# Altium project CM4_mini_BOT.PrjPcb
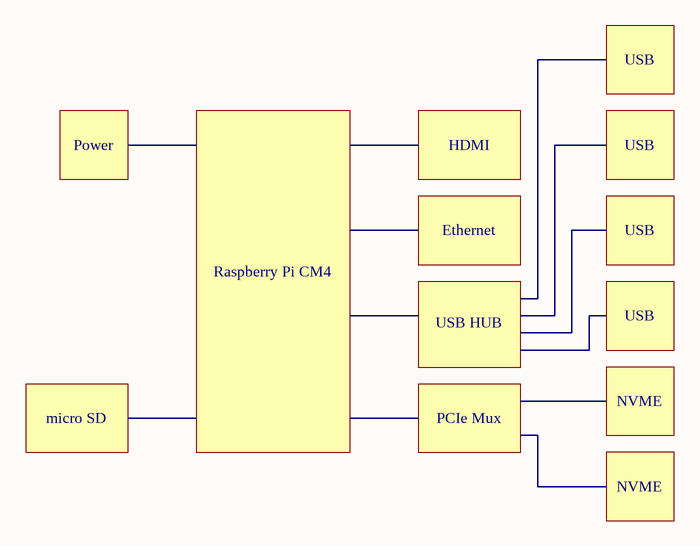
[diagram p0: Block scheme.SchDoc]
8 sheets, 60 parts. Net scope: global (net labels, ports and power ports of the same name join across sheets).
Board file: CM4mini.PcbDoc
Sheets:
  Block scheme.SchDoc
  Power block scheme.SchDoc
  CM4.SchDoc
  Fan.SchDoc
  MicroSD Card.SchDoc
  Power.SchDoc
  USB A.SchDoc
  M.2 m-key.SchDoc

## Sheet Block scheme.SchDoc
size A4; Organization: My Company; Address1: Address Line 1; Address2: Address Line 2; Address3: Address Line 3; Address4: Address Line 4; SheetNumber: 1; SheetTotal: 8

### Notes on the sheet
- USB
- Power
- HDMI
- Ethernet
- Raspberry Pi CM4
- USB HUB
- NVME
- micro SD
- PCIe Mux
- Title:
- Author:
- Approved:
- Size:
- Date:
- Git Hash:
- A4
- Prj:
- SW Version:
- Variant:
- Edited:
- CONFIDENTIAL
- File:

## Sheet Power block scheme.SchDoc
size A4; Organization: My Company; Address1: Address Line 1; Address2: Address Line 2; Address3: Address Line 3; Address4: Address Line 4; SheetNumber: 2; SheetTotal: 8
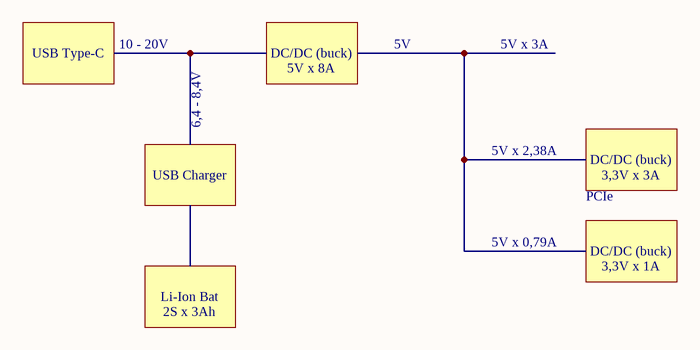
[diagram p1: Power block scheme.SchDoc]

### Notes on the sheet
- USB Type-C
- 10 - 20V
- DC/DC (buck)
- 5V x 8A
- 5V
- 5V x 3A
- 6,4 - 8,4V
- 5V x 2,38A
- USB Charger
- PCIe
- 3,3V x 3A
- Li-Ion Bat
- 2S x 3Ah
- 5V x 0,79A
- 3,3V x 1A
- Title:
- Author:
- Approved:
- Size:
- Date:
- Git Hash:
- A4
- Prj:
- SW Version:
- Variant:
- Edited:
- CONFIDENTIAL
- File:

## Sheet CM4.SchDoc
size A4; SheetNumber: 3; SheetTotal: 8
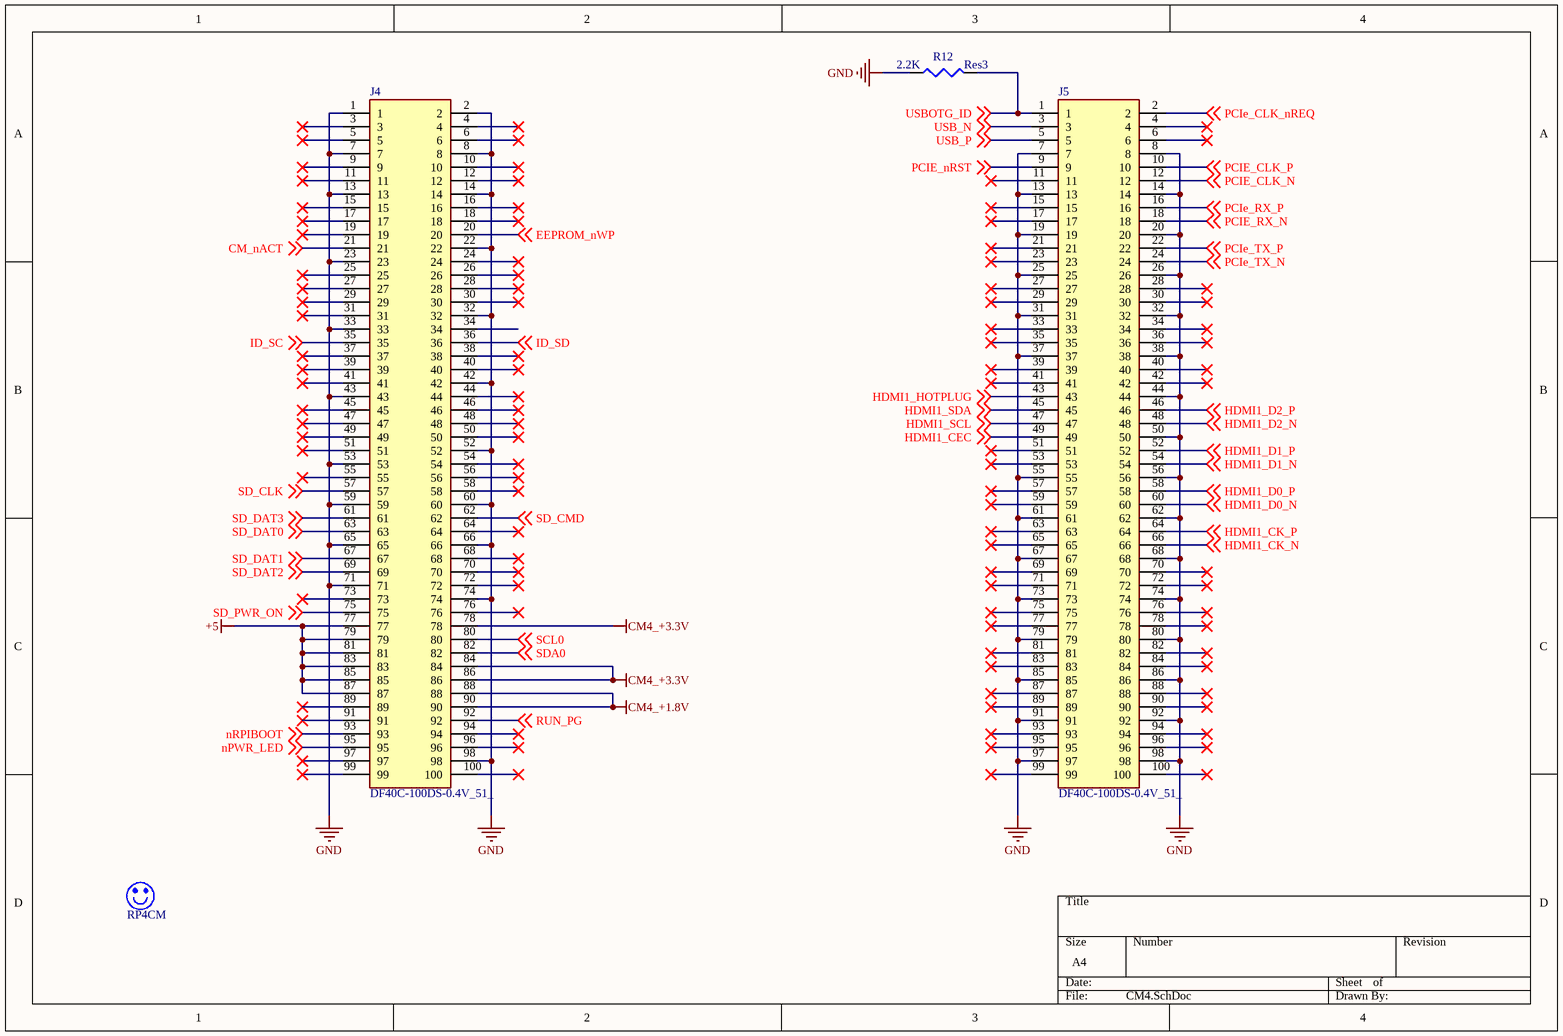
[diagram p2: CM4.SchDoc]

### Parts
J4  DF40C-100DS-0.4V_51_  [DF40C100DS04V51]
J5  DF40C-100DS-0.4V_51_  [DF40C100DS04V51]
M?  RP4CM  [RP4CM0]  (mechanical)
R12  Res3  value 2.2K  [J1-0603]

### Nets
+5: J4.77 J4.79 J4.81 J4.83 J4.85 J4.87
CM4_+1.8V: J4.88 J4.90
CM4_+3.3V: J4.78 J4.84 J4.86
GND: J4.1 J4.2 J4.7 J4.8 J4.13 J4.14 J4.22 J4.23 J4.32 J4.33 J4.42 J4.43 J4.52 J4.53 J4.59 J4.60 J4.65 J4.66 J4.71 J4.74 J4.98 J5.7 J5.8 J5.13 J5.14 J5.19 J5.20 J5.25 J5.26 J5.31 J5.32 J5.37 J5.38 J5.44 J5.50 J5.55 J5.56 J5.61 J5.62 J5.67 J5.68 J5.73 J5.74 J5.79 J5.80 J5.85 J5.86 J5.91 J5.92 J5.97 J5.98 R12.1  [project net PWR_SW]
CM_nACT: J4.21 ; off-sheet CM_nACT
EEPROM_nWP: J4.20 ; off-sheet EEPROM_nWP
HDMI1_CEC: J5.49 ; off-sheet HDMI1_CEC
HDMI1_CK_N: J5.66 ; off-sheet HDMI1_CK_N
HDMI1_CK_P: J5.64 ; off-sheet HDMI1_CK_P
HDMI1_D0_N: J5.60 ; off-sheet HDMI1_D0_N
HDMI1_D0_P: J5.58 ; off-sheet HDMI1_D0_P
HDMI1_D1_N: J5.54 ; off-sheet HDMI1_D1_N
HDMI1_D1_P: J5.52 ; off-sheet HDMI1_D1_P
HDMI1_D2_N: J5.48 ; off-sheet HDMI1_D2_N
HDMI1_D2_P: J5.46 ; off-sheet HDMI1_D2_P
HDMI1_HOTPLUG: J5.43 ; off-sheet HDMI1_HOTPLUG
HDMI1_SCL: J5.47 ; off-sheet HDMI1_SCL
HDMI1_SDA: J5.45 ; off-sheet HDMI1_SDA
ID_SC: J4.35 ; off-sheet ID_SC
ID_SD: J4.36 ; off-sheet ID_SD
nPWR_LED: J4.95 ; off-sheet nPWR_LED
nRPIBOOT: J4.93 ; off-sheet nRPIBOOT
PCIe_CLK_N: J5.12 ; off-sheet PCIE_CLK_N
PCIe_CLK_nREQ: J5.2 ; off-sheet PCIe_CLK_nREQ
PCIe_CLK_P: J5.10 ; off-sheet PCIE_CLK_P
PCIe_nRST: J5.9 ; off-sheet PCIE_nRST
PCIe_RX_N: J5.18 ; off-sheet PCIE_RX_N
PCIe_RX_P: J5.16 ; off-sheet PCIe_RX_P
PCIe_TX_N: J5.24 ; off-sheet PCIe_TX_N
PCIe_TX_P: J5.22 ; off-sheet PCIe_TX_P
RUN_PG: J4.92 ; off-sheet RUN_PG
SCL0: J4.80 ; off-sheet SCL0
SD_CLK: J4.57 ; off-sheet SD_CLK
SD_CMD: J4.62 ; off-sheet SD_CMD
SD_DAT0: J4.63 ; off-sheet SD_DAT0
SD_DAT1: J4.67 ; off-sheet SD_DAT1
SD_DAT2: J4.69 ; off-sheet SD_DAT2
SD_DAT3: J4.61 ; off-sheet SD_DAT3
SD_PWR_ON: J4.75 ; off-sheet SD_PWR_ON
SDA0: J4.82 ; off-sheet SDA0
USB_N: J5.3 ; off-sheet USB_N
USB_P: J5.5 ; off-sheet USB_P
USBOTG_ID: J5.1 R12.2 ; off-sheet USBOTG_ID

Not connected (* = marked no-connect by the designer): J4 3* 4* 5* 6* 9* 10* 11* 12* 15* 16* 17* 18* 19* 24* 25* 26* 27* 28* 29* 30* 31* 34 37* 38* 39* 40* 41* 44* 45* 46* 47* 48* 49* 50* 51* 54* 55* 56* 58* 64* 68* 70* 72* 73* 76* 89* 91* 94* 96* 97* 99* 100*; J5 4* 6* 11* 15* 17* 21* 23* 27* 28* 29* 30* 33* 34* 35* 36* 39* 40* 41* 42* 51* 53* 57* 59* 63* 65* 69* 70* 71* 72* 75* 76* 77* 78* 81* 82* 83* 84* 87* 88* 89* 90* 93* 94* 95* 96* 99* 100*

### Library data of the parts
J4 J5 = DF40C-100DS-0.4V_51_: Connector; Manufacturer_Name: Hirose; Manufacturer_Part_Number: DF40C-100DS-0.4V(51); Datasheet Link: https://www.hirose.com/product/en/download_file/key_name/DF40C-100DS-0.4V%2851%29/category/Drawing%20(2D)/doc_file_id/46856/?file_category_id=6&item_id=06844033451&is_series=; Height: 1.65mm; Mouser Part Number: 798-DF40C100DS0.4V51; Mouser Price/Stock: https://www.mouser.co.uk/ProductDetail/Hirose-Connector/DF40C-100DS-04V51?qs=eDUdFcBPps2MEwbnuPvZzQ%3D%3D; Arrow Part Number: DF40C-100DS-0.4V(51); Arrow Price/Stock: https://www.arrow.com/en/products/df40c-100ds-0.4v-51/hirose-electric
M? = RP4CM: Raspberry Pi  Computed Module 4
R12 = Res3: Resistor; Published: 8-Jun-2000; LatestRevisionDate: 29-May-2009; LatestRevisionNote: IPC-7351 Footprint Added.; PackageReference: J1-0603; Publisher: Altium Limited; PackageDescription: Chip Resistor

## Sheet Fan.SchDoc
size A4; SheetNumber: 4; SheetTotal: 8
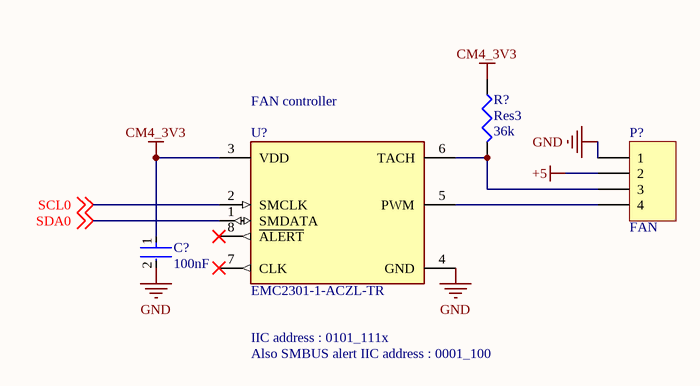
[diagram p3: Fan.SchDoc]

### Parts
(Parts that share a designator on the sheet are numbered #1, #2 ... from top to bottom, then left to right.)
C?#1  100nF  [FP-CC0603-DA-MFG]
P?  FAN  [HDR1X4]
R?  Res3  value 36k  [J1-0603]
U?#1  EMC2301-1-ACZL-TR  [FP-MO-8-TSSOP-3x3-IPC_C]

### Nets
+5: P?.2
CM4_3V3: C?#1.1 R?.1 U?#1.3(VDD)
GND: C?#1.2 P?.1 U?#1.4(GND)  [project net PWR_SW]
SCL0: U?#1.2(SMCLK) ; off-sheet SCL0
SDA0: U?#1.1(SMDATA) ; off-sheet SDA0
NetP?_3: P?.3 R?.2 U?#1.6(TACH)
NetP?_4: P?.4 U?#1.5(PWM)

Not connected (* = marked no-connect by the designer): U?#1 7(CLK)* 8(~{ALERT})*

### Notes on the sheet
- (near U?#1) FAN controller
- IIC address : 0101_111x
- Also SMBUS alert IIC address : 0001_100
- Title:
- Author:
- Approved:
- Size:
- Date:
- Git Hash:
- A4
- Prj:
- SW Version:
- Variant:
- Edited:
- CONFIDENTIAL
- File:

### Library data of the parts
C?#1 = CMP-03422-000924-1: CAP CER 1UF 16V X7R 0603; Manufacturer: YAGEO; Manufacturer Part Number: CC0603KRX7R7BB105; Tolerance: 0.1; Temperature Coefficient: 15%; Material: Ceramic; Package: CC0603-DA; RoHS: TRUE; Device Class L2: Capacitors; Temperature Characteristic: X7R; Temperature: -55°C to +125°C; Temperature Range Low: -55°C; Automotive: No; ComponentLink2Description: Datasheet; Value: 1 uF; Lead Free: Yes; Capacitance: 1 uF; ComponentLink2URL: http://www.yageo.com/documents/recent/UPY-GPHC_X7R_6.3V-to-50V_18.pdf; Device Class L1: Passive Components; Voltage: 16 V; Octopart: https://octopart.com/cc0603krx7r7bb105-yageo-42271928; Category: Cap; Digikey Description: CAP CER 1UF 16V X7R 0603; Footprint Url: http://www.yageo.com/exep/pages/download/literatures/UPY-C_GEN_24.pdf; Height: 0.9mm; Voltage Rating: 16 V; Temperature Range High: +125°C; Mouser Description: Multilayer Ceramic Capacitor, CC Series, 1 - F, - 10%, X7R, 16 V, 0603 [1608 Metric]; Device Class L3: Ceramic Capacitors
P? = Header 4: Header, 4-Pin; LatestRevisionDate: 17-Jul-2002; LatestRevisionNote: Re-released for DXP Platform.; Publisher: Altium Limited
R? = Res3: Resistor; Published: 8-Jun-2000; LatestRevisionDate: 29-May-2009; LatestRevisionNote: IPC-7351 Footprint Added.; PackageReference: J1-0603; Publisher: Altium Limited; PackageDescription: Chip Resistor
U?#1 = CMP-06322-000001-1: IC MOTOR DRIVER 3V-3.6V 8MSOP; Interface: PWM; Min Supply Voltage: 3V; Max Supply Voltage (DC): 3.6V; Operating Supply Current: 350uA; Output Type: Digital; Operating Supply Voltage: 3.3V; Min Supply Voltage (DC): 3V; Min Operating Temperature: -40°C; Number of Pins: 8; Series: -; Max Operating Temperature: 125°C; Case/Package: MSOP; Lead Free: Lead Free; Packaging: Tape and Reel; Package Quantity: 1; Mount: Surface Mount; Max Supply Voltage: 3.6V

## Sheet MicroSD Card.SchDoc
size A4; SheetNumber: 5; SheetTotal: 8
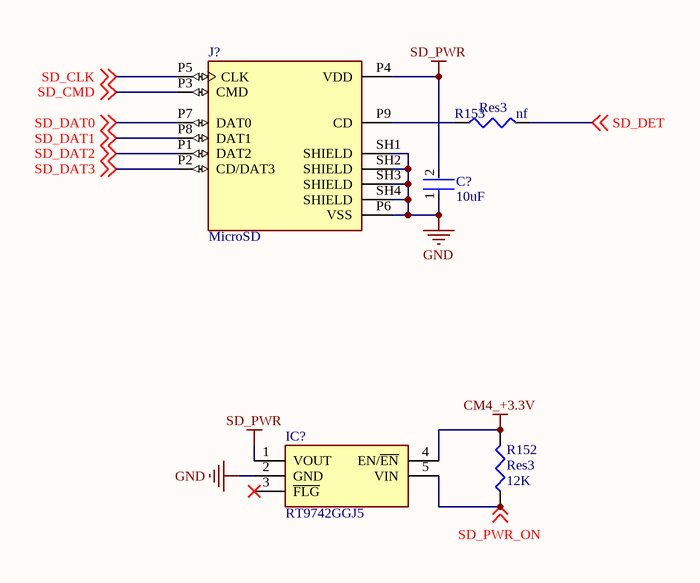
[diagram p4: MicroSD Card.SchDoc]

### Parts
(Parts that share a designator on the sheet are numbered #1, #2 ... from top to bottom, then left to right.)
C?#2  10uF  [FP-CC0603-DA-MFG]
IC?  RT9742GGJ5  [SOT94P280X100-5N]
J?  MicroSD  [GCT_MEM2075-00-140-01-A]
R152  Res3  value 12K  [J1-0603]
R153  Res3  value nf  [J1-0603]

### Nets
CM4_+3.3V: IC?.4(EN/~{EN}) R152.2
GND: C?#2.1 IC?.2(GND) J?.P6(VSS) J?.SH1(SHIELD) J?.SH2(SHIELD) J?.SH3(SHIELD) J?.SH4(SHIELD)  [project net PWR_SW]
SD_PWR: C?#2.2 IC?.1(VOUT) J?.P4(VDD)
SD_CLK: J?.P5(CLK) ; off-sheet SD_CLK
SD_CMD: J?.P3(CMD) ; off-sheet SD_CMD
SD_DAT0: J?.P7(DAT0) ; off-sheet SD_DAT0
SD_DAT1: J?.P8(DAT1) ; off-sheet SD_DAT1
SD_DAT2: J?.P1(DAT2) ; off-sheet SD_DAT2
SD_DAT3: J?.P2(CD/DAT3) ; off-sheet SD_DAT3
SD_DET: R153.2 ; off-sheet SD_DET
SD_PWR_ON: IC?.5(VIN) R152.1 ; off-sheet SD_PWR_ON
NetJ?_P9: J?.P9(CD) R153.1

Not connected (* = marked no-connect by the designer): IC? 3(~{FLG})*

### Library data of the parts
C?#2 = CMP-03422-000924-1: as C?#1 on sheet Fan; Package: CC0603-DA; RoHS: TRUE; Device Class L2: Capacitors; Temperature Characteristic: X7R; Temperature: -55°C to +125°C; Temperature Range Low: -55°C; Automotive: No; ComponentLink2Description: Datasheet; Value: 1 uF; Lead Free: Yes; Capacitance: 1 uF; ComponentLink2URL: http://www.yageo.com/documents/recent/UPY-GPHC_X7R_6.3V-to-50V_18.pdf; Device Class L1: Passive Components; Voltage: 16 V; Octopart: https://octopart.com/cc0603krx7r7bb105-yageo-42271928; Category: Cap; Digikey Description: CAP CER 1UF 16V X7R 0603; Footprint Url: http://www.yageo.com/exep/pages/download/literatures/UPY-C_GEN_24.pdf; Height: 0.9mm; Voltage Rating: 16 V; Temperature Range High: +125°C; Mouser Description: Multilayer Ceramic Capacitor, CC Series, 1 - F, - 10%, X7R, 16 V, 0603 [1608 Metric]; Device Class L3: Ceramic Capacitors
IC? = RT9742GGJ5: Integrated Circuit; Manufacturer_Name: RICHTEK; Datasheet Link: https://componentsearchengine.com/Datasheets/2/RT9742GGJ5.pdf; Height: 1mm; Manufacturer_Part_Number: RT9742GGJ5
J? = MEM2075-00-140-01-A: 9 _8 + 1_ Position Card Connector microSDâ„¢ Surface Mount, Right Angle Gold; MF: Global Connector Technology; Availability: Unavailable; Price: None; SnapEDA_Link: https://www.snapeda.com/parts/MEM2075-00-140-01-A/Global%20Connector%20Technology/view-part/2680480/?ref=snap; Value: *; Package: Package Analog Devices; MP: MEM2075-00-140-01-A
R152 R153 = Res3: Resistor; Published: 8-Jun-2000; LatestRevisionDate: 29-May-2009; LatestRevisionNote: IPC-7351 Footprint Added.; PackageReference: J1-0603; Publisher: Altium Limited; PackageDescription: Chip Resistor

## Sheet Power.SchDoc
size A4; SheetNumber: 6; SheetTotal: 8
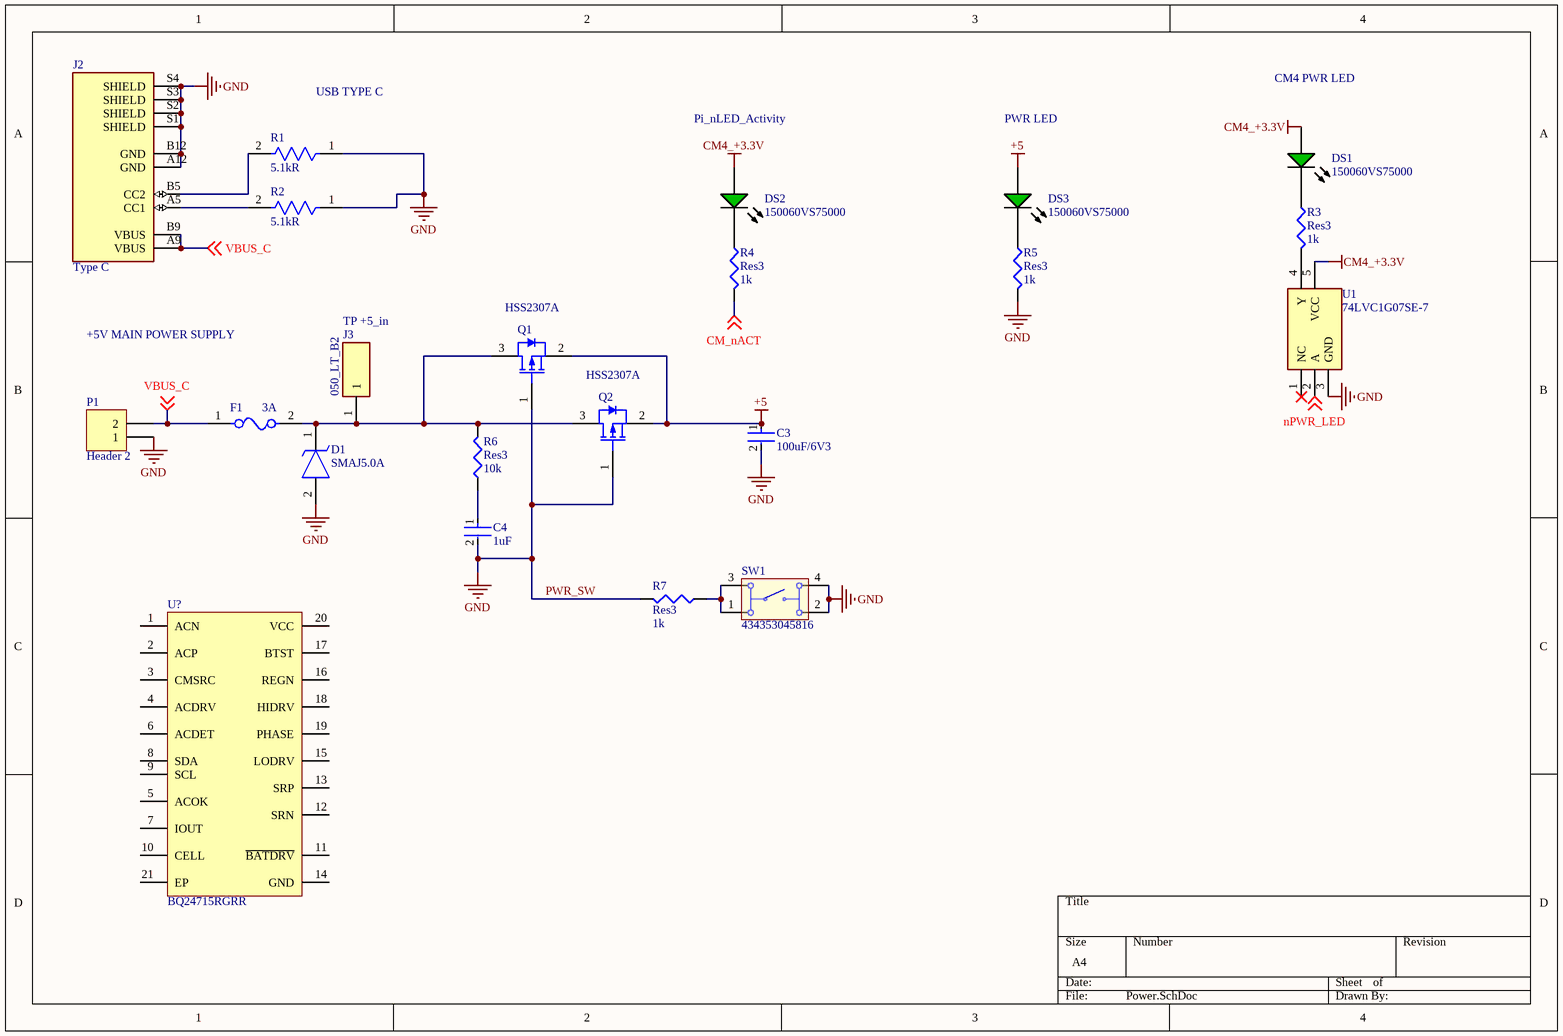
[diagram p5: Power.SchDoc]

### Parts
(Parts that share a designator on the sheet are numbered #1, #2 ... from top to bottom, then left to right.)
C3#1  100uF/6V3  [FP-CC0603-DA-MFG]
C4#1  1uF  [FP-CC0603-DA-MFG]
D1  SMAJ5.0A  [DIOM5026X229N]
DS1  150060VS75000  [WE-150060VS75000_V]
DS2  150060VS75000  [WE-150060VS75000_V]
DS3  150060VS75000  [WE-150060VS75000_V]
F1  3A  [FP-0466-MFG]
J2#1  Type C  [GCT_USB4125-GF-A_REVA2]
J3  050_LT_B2  [050LTB2]
P1#1  Header 2  [HDR1X2]
Q1  HSS2307A  [NXP-SOT23_M]
Q2  HSS2307A  [NXP-SOT23_M]
R1#1  Resistance: 5.1kR  [FP-CRCW0603-e3-IPC_C]  (hidden comment: CRCW06035K10FKEA)
R2#1  Resistance: 5.1kR  [FP-CRCW0603-e3-IPC_C]  (hidden comment: CRCW06035K10FKEA)
R3#1  Res3  value 1k  [J1-0603]
R4#1  Res3  value 1k  [J1-0603]
R5  Res3  value 1k  [J1-0603]
R6  Res3  value 10k  [J1-0603]
R7  Res3  value 1k  [J1-0603]
SW1  434353045816  [434353045816]
U1#1  74LVC1G07SE-7  [SOT65P210X110-5N]
U?#2  BQ24715RGRR  [QFN50P350X350X100-21N-D]

### Nets
+5: C3#1.1 DS3.2(A) Q1.2(S) Q2.2(S)
CM4_+3.3V: DS1.2(A) DS2.2(A) U1#1.5(VCC)
PWR_SW: C3#1.2 C4#1.2 D1.2(A) J2#1.A12(GND) J2#1.B12(GND) J2#1.S1(SHIELD) J2#1.S2(SHIELD) J2#1.S3(SHIELD) J2#1.S4(SHIELD) P1#1.1 Q1.1(G) Q2.1(G) R1#1.1 R2#1.1 R5.2 R7.2 SW1.2 SW1.4 U1#1.3(GND)  [also labelled GND]
CM_nACT: R4#1.2 ; off-sheet CM_nACT
nPWR_LED: U1#1.2(A) ; off-sheet nPWR_LED
VBUS_C: F1.1 J2#1.A9(VBUS) J2#1.B9(VBUS) P1#1.2 ; off-sheet VBUS_C
NetC4#1_1: C4#1.1 R6.1
NetD1_1: D1.1(K) F1.2 J3.1 Q1.3(D) Q2.3(D) R6.2
NetDS1_1: DS1.1(K) R3#1.1
NetDS2_1: DS2.1(K) R4#1.1
NetDS3_1: DS3.1(K) R5.1
NetJ2#1_A5: J2#1.A5(CC1) R2#1.2
NetJ2#1_B5: J2#1.B5(CC2) R1#1.2
NetR3#1_2: R3#1.2 U1#1.4(Y)
NetR7_1: R7.1 SW1.1 SW1.3

Not connected (* = marked no-connect by the designer): U1#1 1(NC)*; U?#2 1(ACN) 2(ACP) 3(CMSRC) 4(ACDRV) 5(ACOK) 6(ACDET) 7(IOUT) 8(SDA) 9(SCL) 10(CELL) 11(~{BATDRV}) 12(SRN) 13(SRP) 14(GND) 15(LODRV) 16(REGN) 17(BTST) 18(HIDRV) 19(PHASE) 20(VCC) 21(EP)

### Notes on the sheet
- USB TYPE C
- CM4 PWR LED
- Pi_nLED_Activity
- PWR LED
- +5V MAIN POWER SUPPLY
- TP +5_in

### Library data of the parts
C3#1 C4#1 = CMP-03422-000924-1: as C?#1 on sheet Fan; Package: CC0603-DA; RoHS: TRUE; Device Class L2: Capacitors; Temperature Characteristic: X7R; Temperature: -55°C to +125°C; Temperature Range Low: -55°C; Automotive: No; ComponentLink2Description: Datasheet; Value: 1 uF; Lead Free: Yes; Capacitance: 1 uF; ComponentLink2URL: http://www.yageo.com/documents/recent/UPY-GPHC_X7R_6.3V-to-50V_18.pdf; Device Class L1: Passive Components; Voltage: 16 V; Octopart: https://octopart.com/cc0603krx7r7bb105-yageo-42271928; Category: Cap; Digikey Description: CAP CER 1UF 16V X7R 0603; Footprint Url: http://www.yageo.com/exep/pages/download/literatures/UPY-C_GEN_24.pdf; Height: 0.9mm; Voltage Rating: 16 V; Temperature Range High: +125°C; Mouser Description: Multilayer Ceramic Capacitor, CC Series, 1 - F, - 10%, X7R, 16 V, 0603 [1608 Metric]; Device Class L3: Ceramic Capacitors
D1 = SMAJ5.0A: TVS Diode (Uni-directional); Manufacturer_Name: LITTELFUSE; Datasheet Link: https://www.littelfuse.com/~/media/electronics/datasheets/tvs_diodes/littelfuse_tvs_diode_smaj_datasheet.pdf.pdf; Height: 2.29mm; Manufacturer_Part_Number: SMAJ5.0A; Mouser Part Number: 576-SMAJ5.0A; Mouser Price/Stock: https://www.mouser.co.uk/ProductDetail/Littelfuse/SMAJ50A?qs=2VFNtWizgicfetZVA4gWHA%3D%3D; Arrow Part Number: SMAJ5.0A; Arrow Price/Stock: https://www.arrow.com/en/products/smaj5.0a/littelfuse
DS1-DS3 = CMP-1426-00006-4: WL-SMCW SMD Chip LED Top View Monocolor Waterclear, 30 mA, 2 V, -40 to 85 degC, 2-Pin SMD, RoHS, Tape and Reel; DatasheetVersion: Rev. 2.7; PackageDescription: 2-Pin Surface Mount Device, Body 1.6 x 0.8 mm; ComponentLink1URL: https://www.we-online.com/; PartNumber: 150060VS75000; RoHSCompliant: True; ComponentLink2URL: http://katalog.we-online.de/led/datasheet/150060VS75000.pdf; ComponentLink1Description: Manufacturer URL; Mounting Technology: Surface Mount; ComponentLink2Description: Datasheet
F1 = CMP-08605-000054-1: FUSE BOARD MNT 3A 32VAC/VDC 1206; Manufacturer Part Number: 0466003.NR; Manufacturer: Littelfuse; Fuse Interrupt Ac Current: 50A; Fuse Voltage Drop: 75.99mV; Max Fuse Ac Voltage: 32V; Fuse I2T: 0.576A2Sec; Resistance: 0.019Ω; Fuse Blow Speed: Fast; Value: 0.019Ω; ComponentLink2Description: Datasheet; Fuse Current: 3A; RoHS: TRUE; Mouser Description: Surface Mount Fuses 32V 3A VFA Slimline; Height: 0.66mm; Octopart: https://octopart.com/0466003.nr-littelfuse-565175; Package: 0466; Fuse Interrupt Dc Current: 50A; Temperature Range Low: -55°C; ComponentLink2URL: https://www.littelfuse.com/~/media/electronics/datasheets/fuses/littelfuse_fuse_466_datasheet.pdf.pdf; Digikey Description: FUSE BOARD MNT 3A 32VAC/VDC 1206; Voltage Rating: 32V; Category: Fuse; Lead Free: Yes; Device Class L2: Fuses; Automotive: No; Max Fuse Dc Voltage: 32V; Temperature Range High: +90°C; Device Class L3: unset; Device Class L1: Circuit Protection; Temperature: -55°C to +90°C
J2#1 = USB4125-GF-A_REVA2: USB Charge Only Connector Type C Horizontal Receptacle, 3.16mm profile, 6 Pins, Surface mount, Top mount, low cost; MF: Global Connector Technology; Check_prices: https://www.snapeda.com/parts/USB4125-GF-A/Global%20Connector%20Technology/view-part/5160675/?ref=eda; Package: None; MP: USB4125-GF-A; Value: *; Availability: In Stock; SnapEDA_Link: https://www.snapeda.com/parts/USB4125-GF-A/Global%20Connector%20Technology/view-part/5160675/?ref=snap; Price: None
J3 = 050_LT_B2: Connector; Manufacturer_Name: Oxley; Manufacturer_Part_Number: 050/LT/B2; Datasheet Link: http://www.farnell.com/datasheets/2644146.pdf?_ga=2.63921641.795442872.1562935128-2061028581.1560430415; Height: 4.5mm
P1#1 = Header 2: Header, 2-Pin; LatestRevisionDate: 17-Jul-2002; LatestRevisionNote: Re-released for DXP Platform.; Publisher: Altium Limited
Q1 Q2 = CMP-1258-00153-1: P-Channel Enhancement Mode MOS Transistor, -60 V, -0.3 A, -55 to 150 degC, 3-Pin SOT23, Tape and Reel; PartNumber: BSH201,215; Manufacturer: NXP Semiconductors; Ciss [typ] (pF): 70; Qr [typ] (nC): 58; VGSth [typ] (V): -1.9; Channel Type: P; Coss [typ] (pF): 15; Packing: Tape & Reel; PackageReference: SOT23; Code_JEDEC: TO-236AB; ID [max] (A): -0.3; ComponentLink1URL: http://www.nxp.com/; PackageDescription: 3-Pin Small Outline Transistor Package, Body 2.9 x 1.3 mm, Pitch 0.95 mm; PackageVersion: 06-03-16, 03/2006; DatasheetVersion: Rev. 1.000; ComponentLink2URL: http://www.nxp.com/documents/data_sheet/BSH201.pdf; Mounting Technology: Surface Mount; ComponentLink1Description: Manufacturer URL; ComponentLink2Description: Datasheet; ComponentLink3Description: Package Specification; ComponentLink3URL: http://www.nxp.com/documents/outline_drawing/sot023_po.pdf; VDS [max] (V): -60
R1#1 R2#1 = CMP-1012-00590-3: RES Thick Film, 5.1kΩ, 1%, 0.1W, 100ppm/°C, 0603; Power Rating: 100mW; Voltage Rating (DC): 75V; Width: 0.85mm; Depth: 0.85mm; Military Standard: Not; Package Quantity: 5000; Case Code (Metric): 1608; Length: 1.55mm; Weight: 7.1E-05oz; Packaging: Tape and Reel; Temperature Coefficient: 100ppm/°C; Case Code (Imperial): 0603; Lead Free: Lead Free; Radiation Hardening: No; Contact Plating: Tin; Composition: Thick Film; Max Operating Temperature: 155°C; Termination: SMD/SMT; Case/Package: 0603; Min Operating Temperature: -55°C; Tolerance: 1%; Voltage Rating: 75V; Mount: Surface Mount; Height: 0.45mm
R3#1 R4#1 R5-R7 = Res3: Resistor; Published: 8-Jun-2000; LatestRevisionDate: 29-May-2009; LatestRevisionNote: IPC-7351 Footprint Added.; PackageReference: J1-0603; Publisher: Altium Limited; PackageDescription: Chip Resistor
SW1 = CMP-1462-00002-1: WS-TASU J-Bend SMD Tact Switch 4.7X3.5 mm side push; Manufacturer: Wuerth Elektronik; NoPins: 04; PartNumber: 434353045816; ComponentLink2Description: Datasheet; ComponentLink1URL: http://www.we-online.com; ComponentLink1Description: Manufacturer URL; ComponentLink2URL: http://katalog.we-online.de/em/datasheet/434353045816.pdf; PackageReference: 434353045816
U1#1 = 74LVC1G07SE-7: Undefined or Miscellaneous; Manufacturer_Name: Diodes Inc.; Datasheet Link: https://componentsearchengine.com/Datasheets/2/74LVC1G07SE-7.pdf; Height: 1.1mm; Manufacturer_Part_Number: 74LVC1G07SE-7; Mouser Part Number: 621-74LVC1G07SE-7; Mouser Price/Stock: https://www.mouser.co.uk/ProductDetail/Diodes-Incorporated/74LVC1G07SE-7?qs=abZ1nkZpTuNoZmx9wrxFdA%3D%3D; Arrow Part Number: 74LVC1G07SE-7; Arrow Price/Stock: https://www.arrow.com/en/products/74lvc1g07se-7/diodes-incorporated
U?#2 = BQ24715RGRR: Integrated Circuit; Manufacturer_Name: Texas Instruments; Datasheet Link: http://www.ti.com/lit/gpn/bq24715; Height: 1mm; Manufacturer_Part_Number: BQ24715RGRR; Mouser Part Number: 595-BQ24715RGRR; Mouser Price/Stock: https://www.mouser.co.uk/ProductDetail/Texas-Instruments/BQ24715RGRR?qs=biyDIajrTn47XBzYmaZUww%3D%3D; Arrow Part Number: BQ24715RGRR; Arrow Price/Stock: https://www.arrow.com/en/products/bq24715rgrr/texas-instruments

## Sheet USB A.SchDoc
size A4; SheetNumber: 8; SheetTotal: 9
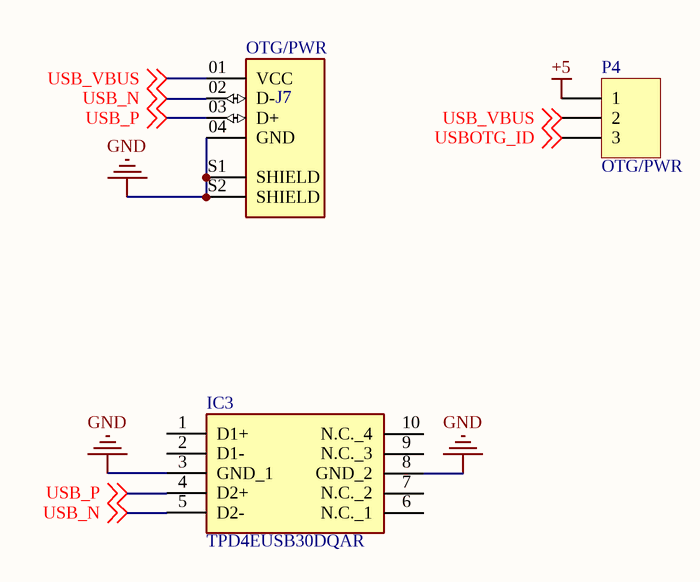
[diagram p6: USB A.SchDoc]

### Parts
IC3  TPD4EUSB30DQAR  [DQA(R-PUSON-N10)]
J7  OTG/PWR  [SAMTEC_USB-A-S-X-X-SM2]
P4  OTG/PWR  [HDR1X3]

### Nets
+5: P4.1
GND: IC3.3(GND_1) IC3.8(GND_2) J7.04(GND) J7.S1(SHIELD) J7.S2(SHIELD)  [project net PWR_SW]
USB_N: IC3.5(D2-) J7.02(D-) ; off-sheet USB_N
USB_P: IC3.4(D2+) J7.03(D+) ; off-sheet USB_P
USB_VBUS: J7.01(VCC) P4.2 ; off-sheet USB_VBUS
USBOTG_ID: P4.3 ; off-sheet USBOTG_ID

Not connected (* = marked no-connect by the designer): IC3 1(D1+) 2(D1-) 6(N.C._1) 7(N.C._2) 9(N.C._3) 10(N.C._4)

### Library data of the parts
IC3 = TPD4EUSB30DQAR: Integrated Circuit; Manufacturer_Name: Texas Instruments; Datasheet Link: http://www.ti.com/lit/gpn/tpd4eusb30; Manufacturer_Part_Number: TPD4EUSB30DQAR; Mouser Part Number: 595-TPD4EUSB30DQAR; Mouser Price/Stock: https://www.mouser.co.uk/ProductDetail/Texas-Instruments/TPD4EUSB30DQAR?qs=Ze4%2FuFuz19JpY4uqYOLMbQ%3D%3D; Arrow Part Number: TPD4EUSB30DQAR; Arrow Price/Stock: https://www.arrow.com/en/products/tpd4eusb30dqar/texas-instruments?region=nac
J7 = USB-A-S-X-X-SM2: USB-A (USB TYPE-A) USB 2.0 Receptacle Connector 4 Position Surface Mount, Right Angle; MP: USB-A-S-F-B-SM2; MF: Samtec; SnapEDA_Link: https://www.snapeda.com/parts/USB-A-S-F-B-SM2/Samtec%20Inc./view-part/937545/?ref=snap; Value: *; Availability: Unavailable; DigiKey-Purchase-URL: https://snapeda.com/shop?store=DigiKey&id=937545; Package: None; Toby_UK-Purchase-URL: https://snapeda.com/shop?store=Toby+UK&id=937545; Price: None
P4 = Header 3: Header, 3-Pin; LatestRevisionDate: 17-Jul-2002; LatestRevisionNote: Re-released for DXP Platform.; Publisher: Altium Limited

## Sheet M.2 m-key.SchDoc
size A4; SheetNumber: 1; SheetTotal: 1
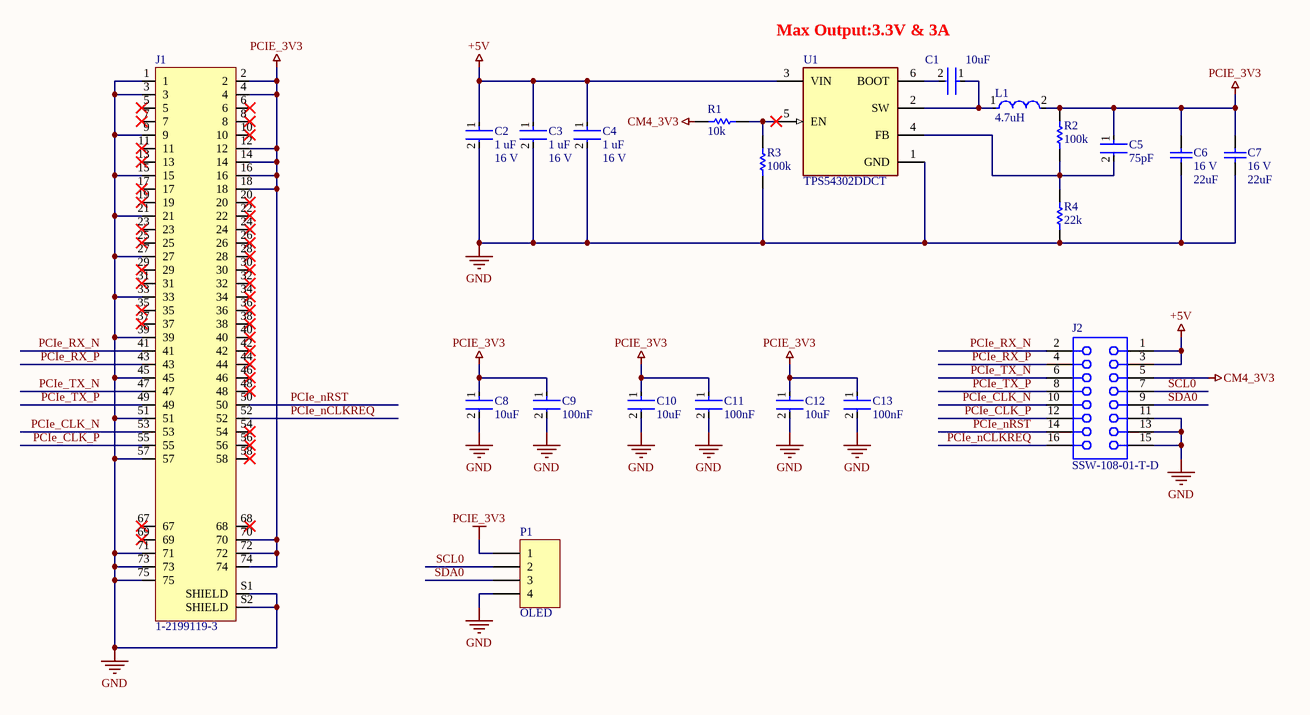
[diagram p7: M.2 m-key.SchDoc]

### Parts
(Parts that share a designator on the sheet are numbered #1, #2 ... from top to bottom, then left to right.)
C1  10uF  [FP-CC0603-DA-MFG]
C2  Capacitance: 1 uF  Voltage: 16 V  [FP-CC0603-DA-MFG]  (hidden comment: 1uF)
C3#2  Capacitance: 1 uF  Voltage: 16 V  [FP-CC0603-DA-MFG]  (hidden comment: 1uF)
C4#2  value 1 uF  Voltage: 16 V  [FP-CC0603-DA-MFG]  (hidden comment: 100nF)
C5  75pF  [FP-CC0603-DA-MFG]
C6  value 22uF  Rated Voltage: 16 V  [CAPC1206(3216)190_N]  (hidden comment: CAP 22uF 16V 1206(3216))
C7  value 22uF  Rated Voltage: 16 V  [CAPC1206(3216)190_N]  (hidden comment: CAP 22uF 16V 1206(3216))
C8  10uF  [FP-CC0603-DA-MFG]
C9  100nF  [FP-CC0603-DA-MFG]
C10  10uF  [FP-CC0603-DA-MFG]
C11  100nF  [FP-CC0603-DA-MFG]
C12  10uF  [FP-CC0603-DA-MFG]
C13  100nF  [FP-CC0603-DA-MFG]
J1  1-2199119-3  [1-2199119-3]
J2#2  SSW-108-01-T-D  [SMTC-SSW-108-01-X-D]
L1  Inductance: 4.7uH  [FP-XAL4030-472MEC-MFG]  (hidden comment: XAL4030-472MEC)
P1#2  OLED  [HDR1X4]
R1#2  Resistance: 10k  [RESC1608X55X25ML10T15]  (hidden comment: RC0603JR-0710KL)
R2#2  Resistance: 100k  [RESC1608X55X25ML10T15]  (hidden comment: RC0603FR-13100KL)
R3#2  Resistance: 100k  [RESC1608X55X25LL10T15]  (hidden comment: RC0603JR-10100KL)
R4#2  Resistance: 22k  [RESC1608X55X25ML10T15]  (hidden comment: RC0603FR-1022KL)
U1#2  TPS54302DDCT  [FP-DDC0006A-MFG]

### Nets
+5V: C2.1 C3#2.1 C4#2.1 J2#2.1 J2#2.3 U1#2.3(VIN)
CM4_3V3: J2#2.5 R1#2.2
GND: C2.2 C3#2.2 C4#2.2 C6.2 C7.2 C8.2 C9.2 C10.2 C11.2 C12.2 C13.2 J1.1 J1.3 J1.9 J1.15 J1.21 J1.27 J1.33 J1.39 J1.45 J1.51 J1.57 J1.71 J1.73 J1.75 J1.S1(SHIELD) J1.S2(SHIELD) J2#2.11 J2#2.13 J2#2.15 P1#2.4 R3#2.1 R4#2.2 U1#2.1(GND)  [project net PWR_SW]
PCIE_3V3: C5.1 C6.1 C7.1 C8.1 C9.1 C10.1 C11.1 C12.1 C13.1 J1.2 J1.4 J1.12 J1.14 J1.16 J1.18 J1.70 J1.72 J1.74 L1.2 P1#2.1 R2#2.1
PCIe_CLK_N: J1.53 J2#2.10
PCIe_CLK_P: J1.55 J2#2.12
PCIe_nCLKREQ: J1.52 J2#2.16
PCIe_nRST: J1.50 J2#2.14
PCIe_RX_N: J1.41 J2#2.2
PCIe_RX_P: J1.43 J2#2.4
PCIe_TX_N: J1.47 J2#2.6
PCIe_TX_P: J1.49 J2#2.8
SCL0: J2#2.7 P1#2.2
SDA0: J2#2.9 P1#2.3
NetC1_1: C1.1 L1.1 U1#2.2(SW)
NetC1_2: C1.2 U1#2.6(BOOT)
NetC5_2: C5.2 R2#2.2 R4#2.1 U1#2.4(FB)
NetR1#2_1: R1#2.1 R3#2.2 U1#2.5(EN)

Not connected (* = marked no-connect by the designer): J1 5* 6* 7* 8* 10* 11* 13* 17* 19* 20* 22* 23* 24* 25* 26* 28* 29* 30* 31* 32* 34* 35* 36* 37* 38* 40* 42* 44* 46* 48* 54* 56* 58* 67* 68* 69*

### Notes on the sheet
- Max Output:3.3V & 3A
- Title:
- Author:
- Approved:
- Size:
- Date:
- Git Hash:
- A4
- Prj:
- SW Version:
- Variant:
- Edited:
- CONFIDENTIAL
- File:

### Library data of the parts
C1 C2 C3#2 C4#2 C5 C8-C13 = CMP-03422-000924-1: as C?#1 on sheet Fan; Package: CC0603-DA; RoHS: TRUE; Device Class L2: Capacitors; Temperature Characteristic: X7R; Temperature: -55°C to +125°C; Temperature Range Low: -55°C; Automotive: No; ComponentLink2Description: Datasheet; Lead Free: Yes; ComponentLink2URL: http://www.yageo.com/documents/recent/UPY-GPHC_X7R_6.3V-to-50V_18.pdf; Device Class L1: Passive Components; Octopart: https://octopart.com/cc0603krx7r7bb105-yageo-42271928; Category: Cap; Digikey Description: CAP CER 1UF 16V X7R 0603; Footprint Url: http://www.yageo.com/exep/pages/download/literatures/UPY-C_GEN_24.pdf; Height: 0.9mm; Voltage Rating: 16 V; Temperature Range High: +125°C; Mouser Description: Multilayer Ceramic Capacitor, CC Series, 1 - F, - 10%, X7R, 16 V, 0603 [1608 Metric]; Device Class L3: Ceramic Capacitors
  C1 C5 C8-C13: Value: 1 uF; Capacitance: 1 uF; Voltage: 16 V
  C2 C3#2: Value: 1 uF
  C4#2: Capacitance: 1 uF
C6 C7 = CMP-1037-04992-1: CAP 22uF 16V ±10% 1206 (3216 Metric) Thickness 1.9mm SMD; Case-EIA: 1206; Case-Metric: 3216; Tolerance: Â±10%; Technology: SMT; Max Thickness: 1.9 mm
J1 = 1-2199119-3: m.2 0.5pitch 3.2h Key m Goldflash; MF: {'manufacturer': u'TE Connectivity'}; Value: *; Price: None; MP: 1-2199119-3; Availability: Unavailable; Package: None
J2#2 = CMP-1023-00375-1: SQ Post Socket, Through-hole, Vertical, -55 to 105 degC, 2.54mm Pitch, 16-Pin, Female, RoHS; Manufacturer: Samtec; ComponentLink3Description: Package Specification; Orientation: Vertical; RoHS: True; PackageReference: SSW-108-01-X-D; PartNumber: SSW-108-01-T-D; PackageDescription: Assembly, Socket Strip .016 X .031 Tail; ComponentLink2Description: Datasheet; ComponentLink1URL: http://www.samtec.com; PackageVersion: CA, 6/1987; ComponentLink1Description: Manufacturer URL; Mounting Technology: Through-hole; DatasheetVersion: F-214; ComponentLink3URL: http://www.samtec.com/documents/webfiles/cpdf/SSW-1XX-XX-XXX-X-XX-XXX-XX-MKT.pdf; ComponentLink2URL: http://www.samtec.com/documents/webfiles/pdf/SSW_TH.PDF; Pitch: 2.54 mm; Temperature Range: -55 to 105 degC
L1 = CMP-11268-000082-1: Power Inductor (SMD), 4.7 µH, 5.1 A, Shielded, 4.5 A, XAL40xx Series, 4mm x 4mm x 3.1mm; Tolerance: 20%; DC Resistance (DCR): 44.1mR; Saturation Current: 4.5A; Max DC Current: 5.1A; Self Resonant Frequency: 36MHz; Test Frequency: 100kHz; Core Material: Composite; REACH SVHC: No SVHC; Height: 3.1mm; Package Quantity: 500; Width: 4.3mm; Mount: Surface Mount; RoHS Compliant: Yes; Case/Package: SMD/SMT; Length: 4.3mm; Packaging: Tape and Reel; Max Operating Temperature: 125°C; Min Operating Temperature: -40°C; Series: XAL4030; Termination: SMD/SMT; Inductance Tolerance: 20%; Shielding: Shielded; RMS Current (Irms): 5.1A; Lead Free: Contains Lead
P1#2 = Header 4: Header, 4-Pin; LatestRevisionDate: 17-Jul-2002; LatestRevisionNote: Re-released for DXP Platform.; Publisher: Altium Limited
R1#2 = CMP-2000-05022-1: Resistor, 10 KOhm, +/- 5%, 100 mW, -55 to 155 degC, 0603 (1608 Metric), RoHS, Tape and Reel; Manufacturer: Yageo; Voltage Rating: 50V; Temperature Coefficient: 100PPM/C; Power Rating: 100mW; Package Reference: 603; Series: RC; Case Code - mm: 1608; Packaging: Reel; Datasheet URL: http://www.farnell.com/datasheets/443971.pdf; Datasheet Version: Rev. 4, 04/2009; Operating Temperature Range: -55Cto+155C; Product: ThickFilmResistorsGeneralPurpose; Package Description: 2-Pin Surface Mount Device, Body 1.6 x 0.8 mm; Manufacturer URL: http://www.yageo.com/; Case Code - in: 0603; Tolerance: 5%; Termination Style: SMD/SMT
R2#2 = CMP-2000-04193-1: Manufacturer: Yageo; Part Number: RC0603FR-13100KL
R3#2 = CMP-2000-04301-1: Manufacturer: Yageo; Part Number: RC0603JR-10100KL
R4#2 = CMP-2000-04179-1: Manufacturer: Yageo; Part Number: RC0603FR-1022KL
U1#2 = CMP-04918-000098-1: IC REG BUCK ADJ 3A TSOT23-6; Manufacturer: Texas Instruments; Max Duty Cycle: 100%; Standoff Height: 0mm; Max Junction Temp: +125°C; Min Supply Voltage: 4.5V; Nominal Supply Current: 45uA; Output Voltage: 0.6-26V; Max Supply Voltage: 28V; Output Type: AdjustableProgrammable; Number Of Outputs: 1; Switching Frequency: 400kHz; Temperature Range High: +125°C; Switching Topology: Buck; Device Class L3: Voltage Regulators - Switching; Device Class L2: Power Management ICs; Lead Free: Yes; Height: 1.1mm; Package: DDC0006A; ComponentLink2Description: Datasheet; Device Class L1: Integrated Circuits (ICs); Manufacturer Part Number: TPS54302DDCT; Output Current: 3A; ComponentLink2URL: http://www.ti.com/lit/ds/symlink/tps54302.pdf; Automotive: No; Digikey Description: IC REG BUCK ADJ 3A TSOT23-6; Octopart: https://octopart.com/tps54302ddct-texas+instruments-74209026; RoHS: TRUE; Category: IC; Temperature Range Low: -40°C; Temperature: -40°C to +125°C

## Nets that join several sheets
+5: CM4 (6 pins), Fan (P?.2), Power (C3#1.1 DS3.2 Q1.2 Q2.2), USB A (P4.1)
CM4_3V3: Fan (C?#1.1 R?.1 U?#1.3), M.2 m-key (J2#2.5 R1#2.2)
CM4_+3.3V: CM4 (J4.78 J4.84 J4.86), MicroSD Card (IC?.4 R152.2), Power (DS1.2 DS2.2 U1#1.5)
PWR_SW: CM4 (52 pins), Fan (C?#1.2 P?.1 U?#1.4), MicroSD Card (7 pins), Power (19 pins), USB A (5 pins), M.2 m-key (34 pins)
CM_nACT: CM4 (J4.21), Power (R4#1.2)
nPWR_LED: CM4 (J4.95), Power (U1#1.2)
PCIe_CLK_N: CM4 (J5.12), M.2 m-key (J1.53 J2#2.10)
PCIe_CLK_P: CM4 (J5.10), M.2 m-key (J1.55 J2#2.12)
PCIe_nRST: CM4 (J5.9), M.2 m-key (J1.50 J2#2.14)
PCIe_RX_N: CM4 (J5.18), M.2 m-key (J1.41 J2#2.2)
PCIe_RX_P: CM4 (J5.16), M.2 m-key (J1.43 J2#2.4)
PCIe_TX_N: CM4 (J5.24), M.2 m-key (J1.47 J2#2.6)
PCIe_TX_P: CM4 (J5.22), M.2 m-key (J1.49 J2#2.8)
SCL0: CM4 (J4.80), Fan (U?#1.2), M.2 m-key (J2#2.7 P1#2.2)
SD_CLK: CM4 (J4.57), MicroSD Card (J?.P5)
SD_CMD: CM4 (J4.62), MicroSD Card (J?.P3)
SD_DAT0: CM4 (J4.63), MicroSD Card (J?.P7)
SD_DAT1: CM4 (J4.67), MicroSD Card (J?.P8)
SD_DAT2: CM4 (J4.69), MicroSD Card (J?.P1)
SD_DAT3: CM4 (J4.61), MicroSD Card (J?.P2)
SD_PWR_ON: CM4 (J4.75), MicroSD Card (IC?.5 R152.1)
SDA0: CM4 (J4.82), Fan (U?#1.1), M.2 m-key (J2#2.9 P1#2.3)
USB_N: CM4 (J5.3), USB A (IC3.5 J7.02)
USB_P: CM4 (J5.5), USB A (IC3.4 J7.03)
USBOTG_ID: CM4 (J5.1 R12.2), USB A (P4.3)